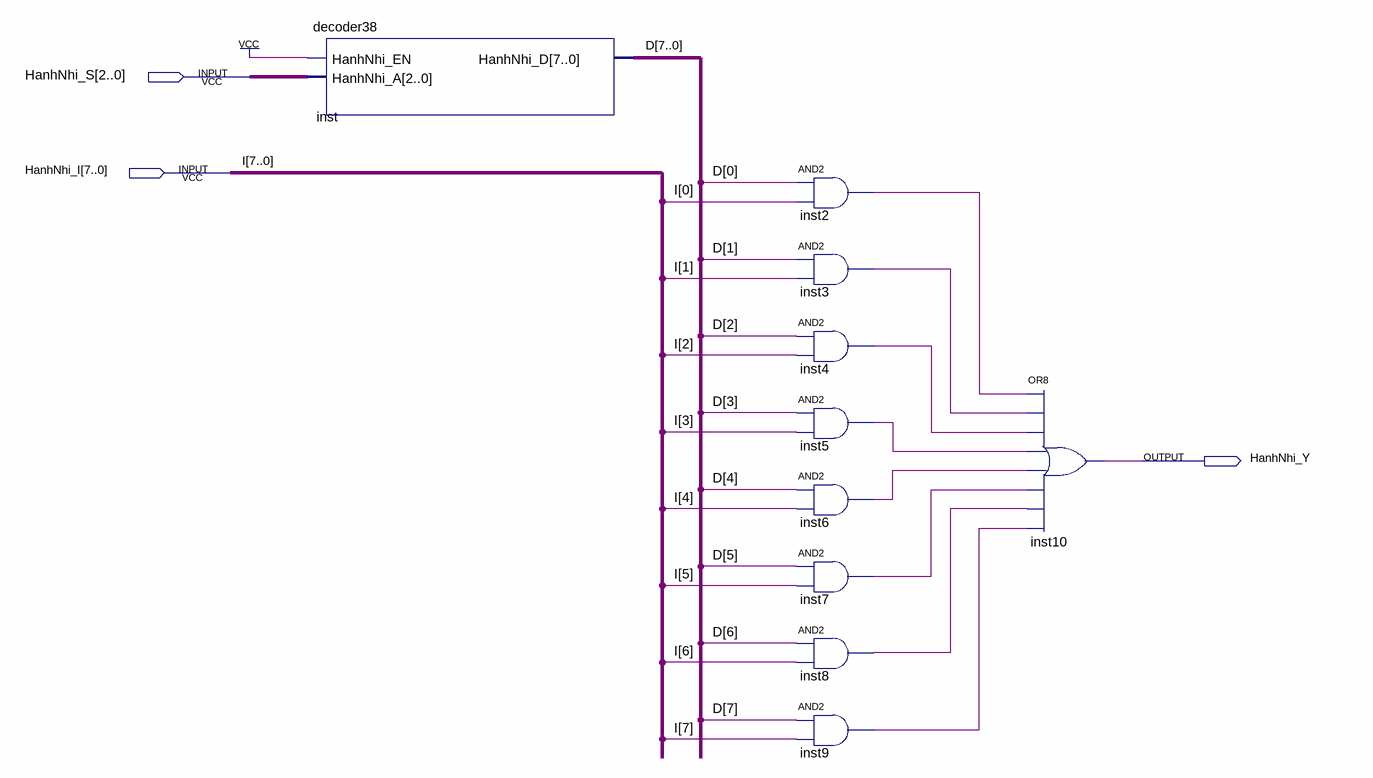
[diagram p0: schematic sheet]
// Quartus schematic multiplexer81.bdf as structural Verilog: 10 symbols, 3 pins
module multiplexer81 (
  input  [2:0] HanhNhi_S,
  input  [7:0] HanhNhi_I,
  output HanhNhi_Y
);

  wire inst2_out, inst3_out, inst4_out, inst5_out, inst6_out, inst7_out, inst8_out, inst9_out;
  wire [7:0] D;

  decoder38 inst (.HanhNhi_EN(1'b1), .HanhNhi_A(HanhNhi_S), .HanhNhi_D(D));
  and inst2 (inst2_out, D[0], HanhNhi_I[0]);
  and inst3 (inst3_out, D[1], HanhNhi_I[1]);
  and inst4 (inst4_out, D[2], HanhNhi_I[2]);
  and inst5 (inst5_out, D[3], HanhNhi_I[3]);
  and inst6 (inst6_out, D[4], HanhNhi_I[4]);
  and inst7 (inst7_out, D[5], HanhNhi_I[5]);
  and inst8 (inst8_out, D[6], HanhNhi_I[6]);
  and inst9 (inst9_out, D[7], HanhNhi_I[7]);
  or inst10 (HanhNhi_Y, inst2_out, inst3_out, inst4_out, inst5_out, inst6_out, inst7_out, inst8_out, inst9_out);

  // Other names for the same wires on the sheet: I[7:0] = HanhNhi_I
endmodule
